# Altium schematic sheet 05_Motor.SchDoc
size A
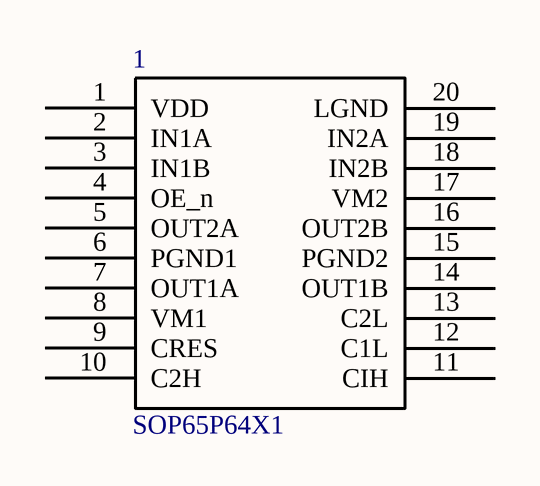
[diagram p0: 05_Motor.SchDoc]

## Parts
1  SOP65P64X1  [SOP65P640X120-20N]

## Nets

Not connected (* = marked no-connect by the designer): 1 1(VDD) 2(IN1A) 3(IN1B) 4(OE_n) 5(OUT2A) 6(PGND1) 7(OUT1A) 8(VM1) 9(CRES) 10(C2H) 11(CIH) 12(C1L) 13(C2L) 14(OUT1B) 15(PGND2) 16(OUT2B) 17(VM2) 18(IN2B) 19(IN2A) 20(LGND)